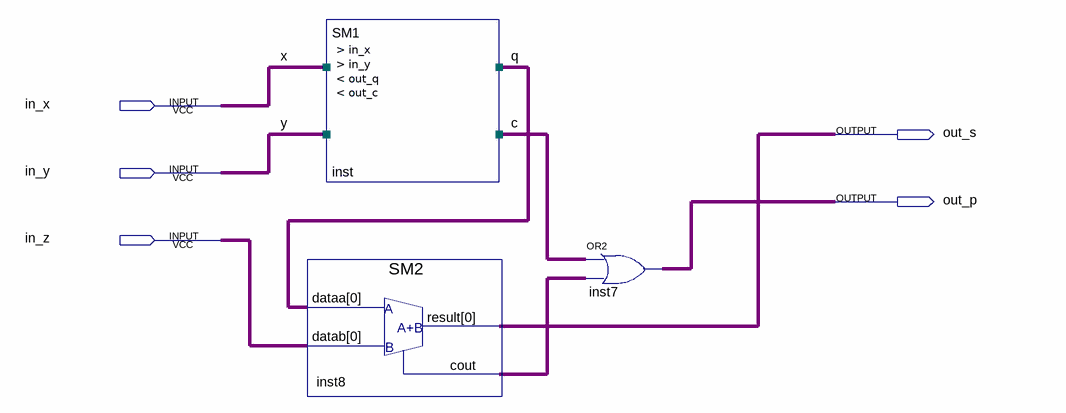
[diagram p0: schematic sheet]
// Quartus schematic KS_Lab1_SM.bdf as structural Verilog: 3 symbols, 5 pins
module KS_Lab1_SM (
  input  in_x,
  input  in_y,
  input  in_z,
  output out_s,
  output out_p
);

  wire c, inst8_cout, q;

  SM2 inst8 (.dataa(q), .datab(in_z), .result(out_s), .cout(inst8_cout));
  SM1 inst (.in_x(in_x), .in_y(in_y), .out_q(q), .out_c(c));
  or inst7 (out_p, c, inst8_cout);

  // Other names for the same wires on the sheet: x = in_x; y = in_y
endmodule
